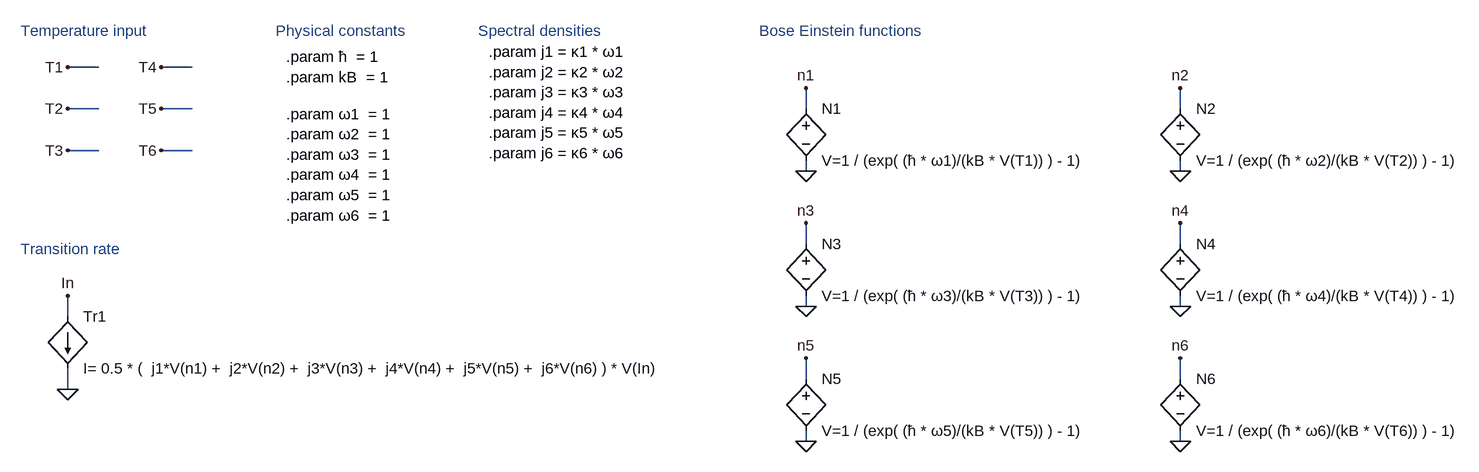
[diagram p0: schematic self_damping_rate.asc]
self_damping_rate.asc, the LTspice schematic file:
Version 4
SHEET 1 1868 680
WIRE -288 -416 -336 -416
WIRE -144 -416 -192 -416
WIRE -288 -352 -336 -352
WIRE -144 -352 -192 -352
WIRE 800 -352 800 -384
WIRE 1376 -352 1376 -384
WIRE -288 -288 -336 -288
WIRE -144 -288 -192 -288
WIRE 800 -256 800 -272
WIRE 1376 -256 1376 -272
WIRE 800 -144 800 -176
WIRE 1376 -144 1376 -176
WIRE 800 -48 800 -64
WIRE 1376 -48 1376 -64
WIRE -336 -32 -336 -64
WIRE 800 64 800 32
WIRE 1376 64 1376 32
WIRE -336 80 -336 48
WIRE 800 160 800 144
WIRE 1376 160 1376 144
FLAG 800 -256 0
FLAG -336 -416 T1
FLAG 800 -384 n1
FLAG -336 -64 In
FLAG -336 -352 T2
FLAG -336 -288 T3
FLAG -192 -416 T4
FLAG -192 -352 T5
FLAG -192 -288 T6
FLAG 1376 -256 0
FLAG 1376 -384 n2
FLAG 800 -48 0
FLAG 800 -176 n3
FLAG 1376 -48 0
FLAG 1376 -176 n4
FLAG 800 160 0
FLAG 800 32 n5
FLAG 1376 160 0
FLAG 1376 32 n6
FLAG -336 80 0
SYMBOL bv 800 -368 R0
SYMATTR InstName N1
SYMATTR Value V=1 / (exp( (ħ * ω1)/(kB * V(T1)) ) - 1)
SYMBOL bi -336 -32 R0
SYMATTR InstName Tr1
SYMATTR Value I= 0.5 * (  j1*V(n1) +  j2*V(n2) +  j3*V(n3) +  j4*V(n4) +  j5*V(n5) +  j6*V(n6) ) * V(In)
SYMBOL bv 1376 -368 R0
SYMATTR InstName N2
SYMATTR Value V=1 / (exp( (ħ * ω2)/(kB * V(T2)) ) - 1)
SYMBOL bv 800 -160 R0
SYMATTR InstName N3
SYMATTR Value V=1 / (exp( (ħ * ω3)/(kB * V(T3)) ) - 1)
SYMBOL bv 1376 -160 R0
SYMATTR InstName N4
SYMATTR Value V=1 / (exp( (ħ * ω4)/(kB * V(T4)) ) - 1)
SYMBOL bv 800 48 R0
SYMATTR InstName N5
SYMATTR Value V=1 / (exp( (ħ * ω5)/(kB * V(T5)) ) - 1)
SYMBOL bv 1376 48 R0
SYMATTR InstName N6
SYMATTR Value V=1 / (exp( (ħ * ω6)/(kB * V(T6)) ) - 1)
TEXT 728 -472 Left 2 ;Bose Einstein functions
TEXT -408 -472 Left 2 ;Temperature input
TEXT -408 -136 Left 2 ;Transition rate
TEXT -16 -472 Left 2 ;Physical constants
TEXT 0 -432 Left 2 !.param ħ  = 1\n.param kB  = 1
TEXT 296 -472 Left 2 ;Spectral densities
TEXT 312 -440 Left 2 !.param j1 = κ1 * ω1\n.param j2 = κ2 * ω2\n.param j3 = κ3 * ω3\n.param j4 = κ4 * ω4\n.param j5 = κ5 * ω5\n.param j6 = κ6 * ω6
TEXT 0 -344 Left 2 !.param ω1  = 1\n.param ω2  = 1\n.param ω3  = 1\n.param ω4  = 1\n.param ω5  = 1\n.param ω6  = 1

The netlist it stands for:
* self_damping_rate.asc
B§N1 n1 0 V=1 / (exp( (ħ * ω1)/(kB * V(T1)) ) - 1)
B§Tr1 In 0 I= 0.5 * (  j1*V(n1) +  j2*V(n2) +  j3*V(n3) +  j4*V(n4) +  j5*V(n5) +  j6*V(n6) ) * V(In)
B§N2 n2 0 V=1 / (exp( (ħ * ω2)/(kB * V(T2)) ) - 1)
B§N3 n3 0 V=1 / (exp( (ħ * ω3)/(kB * V(T3)) ) - 1)
B§N4 n4 0 V=1 / (exp( (ħ * ω4)/(kB * V(T4)) ) - 1)
B§N5 n5 0 V=1 / (exp( (ħ * ω5)/(kB * V(T5)) ) - 1)
B§N6 n6 0 V=1 / (exp( (ħ * ω6)/(kB * V(T6)) ) - 1)
* Bose Einstein functions
* Temperature input
* Transition rate
* Physical constants
.param ħ  = 1
.param kB  = 1
* Spectral densities
.param j1 = κ1 * ω1
.param j2 = κ2 * ω2
.param j3 = κ3 * ω3
.param j4 = κ4 * ω4
.param j5 = κ5 * ω5
.param j6 = κ6 * ω6
.param ω1  = 1
.param ω2  = 1
.param ω3  = 1
.param ω4  = 1
.param ω5  = 1
.param ω6  = 1
.backanno
.end